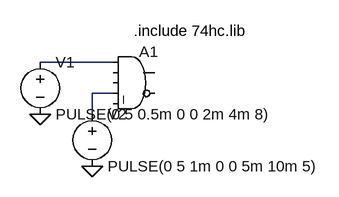
[diagram p0: schematic Draft3.asc]
Draft3.asc, the LTspice schematic file:
Version 4
SHEET 1 880 680
WIRE 256 -16 144 -16
WIRE 256 32 224 32
WIRE 224 64 224 32
FLAG 144 64 0
FLAG 224 144 0
SYMBOL voltage 144 -32 R0
WINDOW 123 0 0 Left 0
WINDOW 39 0 0 Left 0
SYMATTR InstName V1
SYMATTR Value PULSE(0 5 0.5m 0 0 2m 4m 8)
SYMBOL Digital\\and 288 -48 R0
SYMATTR InstName A1
SYMBOL voltage 224 48 R0
WINDOW 123 0 0 Left 0
WINDOW 39 0 0 Left 0
SYMATTR InstName V2
SYMATTR Value PULSE(0 5 1m 0 0 5m 10m 5)
TEXT 288 -64 Left 2 !.include 74hc.lib

The netlist it stands for:
* Draft3.asc
V1 N001 0 PULSE(0 5 0.5m 0 0 2m 4m 8)
A1 N001 0 0 N002 0 0 0 0 AND
V2 N002 0 PULSE(0 5 1m 0 0 5m 10m 5)
.include 74hc.lib
.backanno
.end